# Altium schematic sheet [2]-Power Budget.SchDoc: Mixed Signal Board
size 381 x 241 mm; Author: AVIRAL MISHRA; DocumentNumber: 2; SheetNumber: 2; SheetTotal: 11; PROJECT CODE: A_V1.0
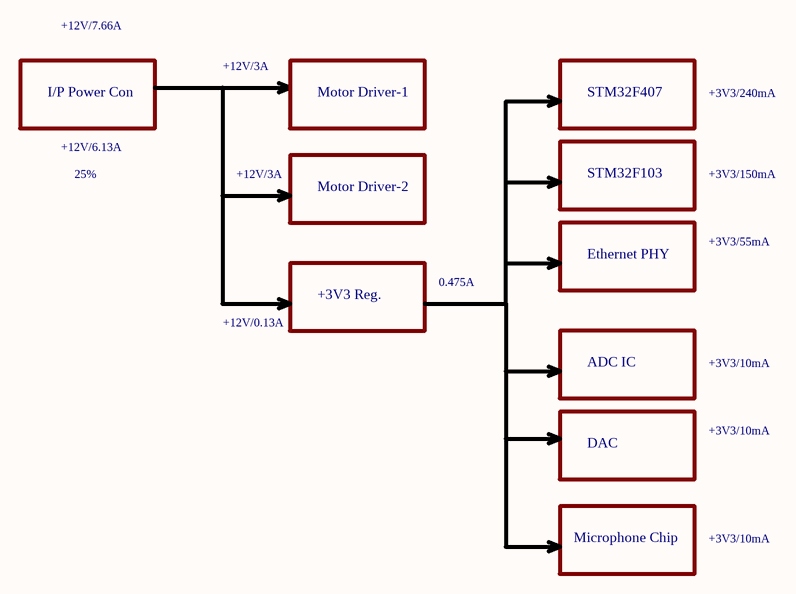
[diagram p0: [2]-Power Budget.SchDoc]

## Notes on the sheet
- +12V/7.66A
- +12V/3A
- I/P Power Con
- +12V/6.13A
- Motor Driver-1
- STM32F407
- +3V3/240mA
- 25%
- Motor Driver-2
- STM32F103
- +3V3/150mA
- 0.475A
- Ethernet PHY
- +3V3/55mA
- +12V/0.13A
- +3V3 Reg.
- ADC IC
- +3V3/10mA
- DAC
- Microphone Chip
- TITLE:
- DOCUMENT NAME:
- SCALE 1:1
- This document is copyright of EsteemPCB and shall not be revealed, produced, copied, in whole or in part, nor
- PROJECT CODE:
- TEMPLATE:
- A4
- AUTHOR:
- Sheet
- of
- used for any purpose other than submitted.